# Altium project 25H_v2.PrjPCB
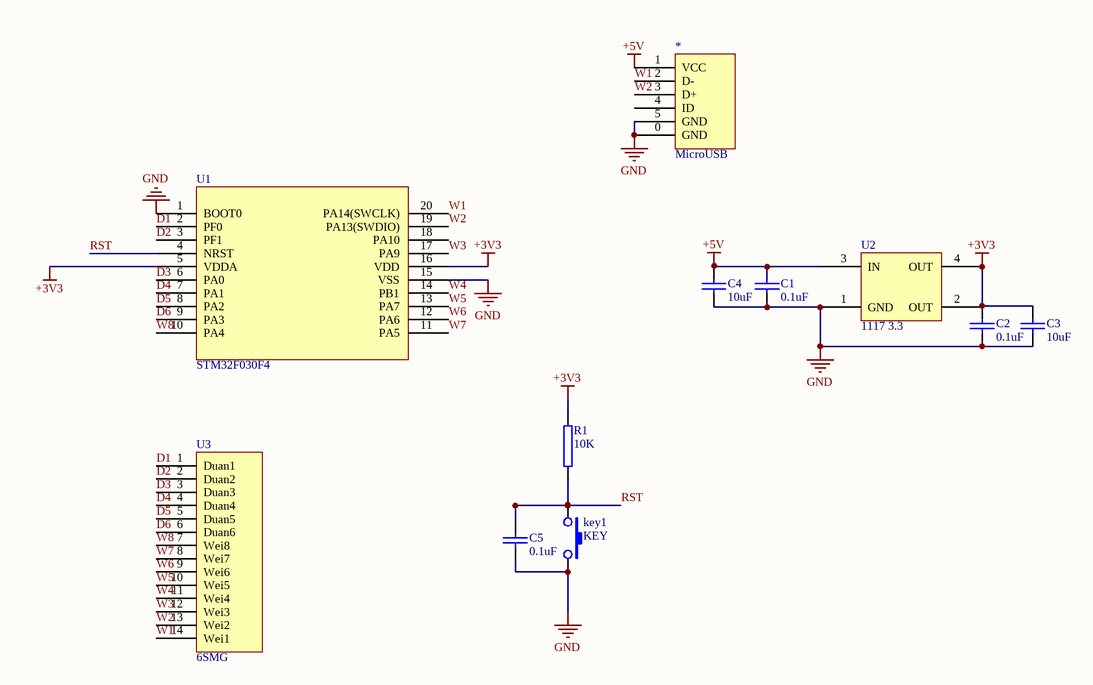
[diagram p0: 25H_v2.SchDoc]
1 sheet, 11 parts. Net scope: global (net labels, ports and power ports of the same name join across sheets).
Board file: 25H_V2.PcbDoc

## Sheet 25H_v2.SchDoc
size A4

### Parts
*  MicroUSB  [MicroUSB]
C1  0.1uF  [C0603]
C2  0.1uF  [C0603]
C3  10uF  [C0603]
C4  10uF  [C0603]
C5  0.1uF  [C0603]
key1  KEY  [KEY4*4*1.7]
R1  10K  [R0603]
U1  STM32F030F4  [TSSOP-20]
U2  1117 3.3  [SOT223]
U3  6SMG  [6SMG]

### Nets
+3V3: C2.1 C3.1 R1.1 U1.5(VDDA) U1.16(VDD) U2.2(OUT) U2.4(OUT)
+5V: *.1(VCC) C1.1 C4.1 U2.3(IN)
GND: *.0(GND) *.5(GND) C1.2 C2.2 C3.2 C4.2 C5.2 key1.2 U1.1(BOOT0) U1.15(VSS) U2.1(GND)
D1: U1.2(PF0) U3.1(Duan1)
D2: U1.3(PF1) U3.2(Duan2)
D3: U1.6(PA0) U3.3(Duan3)
D4: U1.7(PA1) U3.4(Duan4)
D5: U1.8(PA2) U3.5(Duan5)
D6: U1.9(PA3) U3.6(Duan6)
RST: C5.1 key1.1 R1.2 U1.4(NRST)
W1: *.2(D-) U1.20(PA14(SWCLK)) U3.14(Wei1)
W2: *.3(D+) U1.19(PA13(SWDIO)) U3.13(Wei2)
W3: U1.17(PA9) U3.12(Wei3)
W4: U1.14(PB1) U3.11(Wei4)
W5: U1.13(PA7) U3.10(Wei5)
W6: U1.12(PA6) U3.9(Wei6)
W7: U1.11(PA5) U3.8(Wei7)
W8: U1.10(PA4) U3.7(Wei8)

Not connected (* = marked no-connect by the designer): * 4(ID); U1 18(PA10)

### Library data of the parts
C1-C5 = CAP
R1 = RES